# Altium schematic sheet DC-DC Converter-Test.SchDoc
size A; SheetNumber: 1; SheetTotal: 1
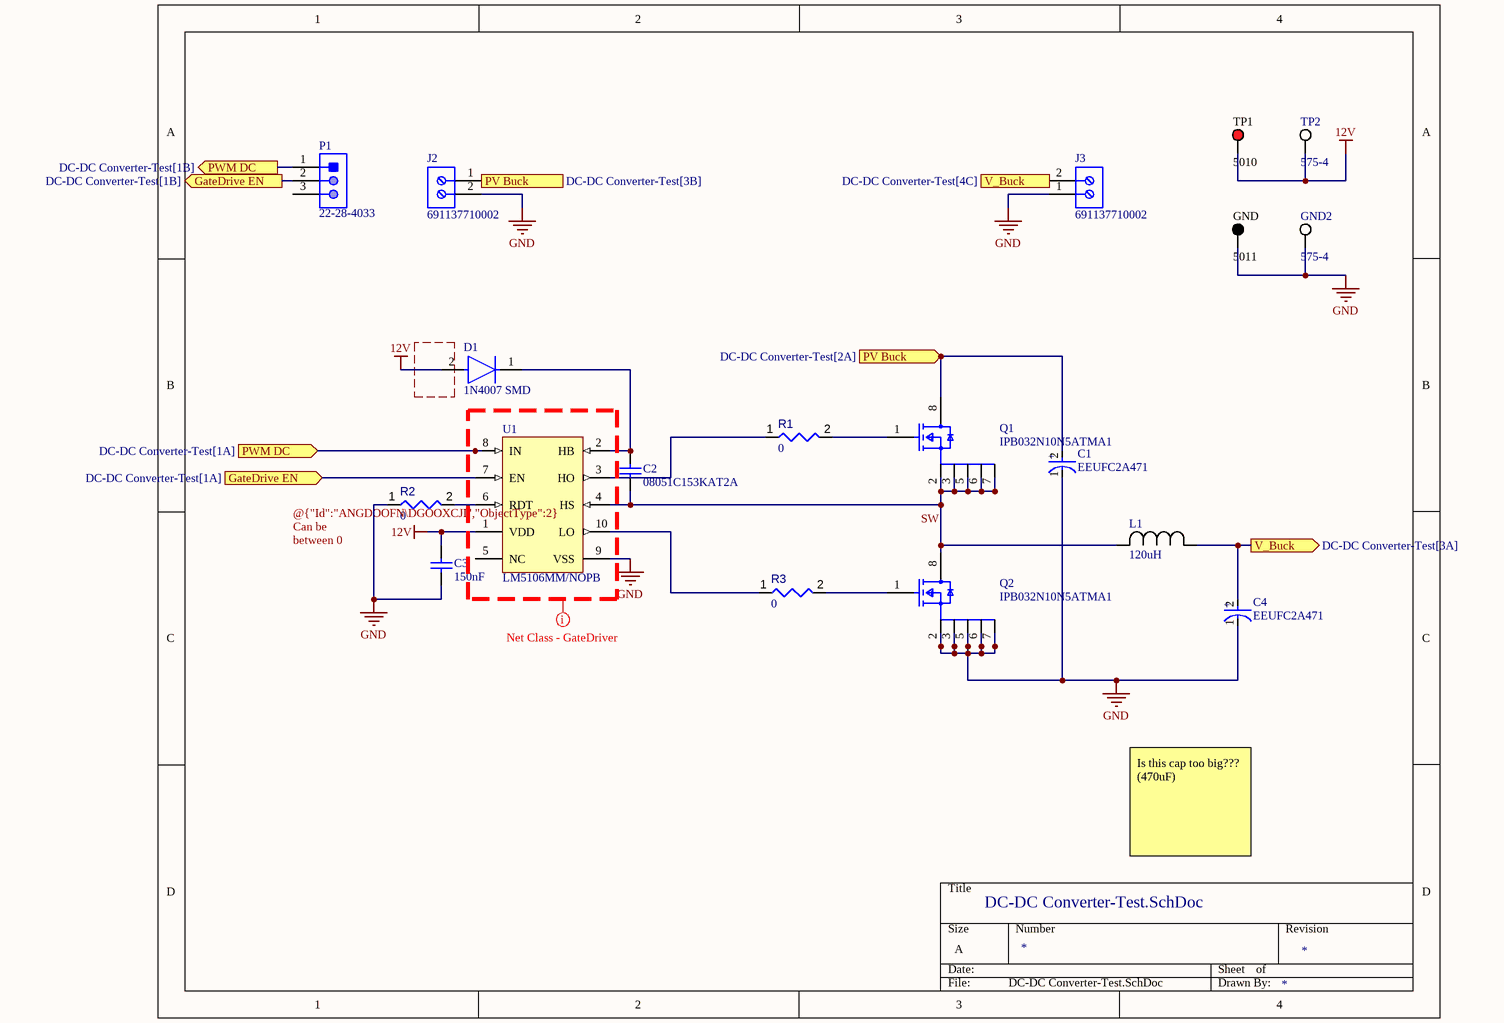
[diagram p0: DC-DC Converter-Test.SchDoc]

## Parts
C1  EEUFC2A471  [FP-RAD-TH-D_16_0_5-L_40_2-MFG]
C2  08051C153KAT2A  [CAPC2013X94X50NL20T25]
C3  150nF  [CAPC2013X140X50LL20T25]
C4  EEUFC2A471  [FP-RAD-TH-D_16_0_5-L_40_2-MFG]
D1  1N4007 SMD  [FP-1N4007_SMD-IPC_C]
GND  5011  [KSTN-5011_V]
GND2  575-4  [KSTN-575-4]
J2  691137710002  [691137710002]
J3  691137710002  [691137710002]
L1  120uH  [IND_2300HT-V_56_42]
P1  22-28-4033  [MOLX-22-28-4033_V]
Q1  IPB032N10N5ATMA1  [FP-PG-TO263-7-MFG]
Q2  IPB032N10N5ATMA1  [FP-PG-TO263-7-MFG]
R1  value 0  [RESC0603(1608)_L]  (hidden comment: 0R3J)
R2  value 0  [RESC0603(1608)_L]  (hidden comment: 0R3J)
R3  value 0  [RESC0603(1608)_L]  (hidden comment: 0R3J)
TP1  5010  [KSTN-5010_V]
TP2  575-4  [KSTN-575-4]
U1  LM5106MM/NOPB  [DGS0010A_N]

## Ports
GateDrive EN (in, see DC-DC Converter-Test[1A]), GateDrive EN (out, see DC-DC Converter-Test[1B]), PV Buck (in, see DC-DC Converter-Test[2A]), PV Buck (out, see DC-DC Converter-Test[3B]), PWM DC (in, see DC-DC Converter-Test[1A]), PWM DC (out, see DC-DC Converter-Test[1B]), V_Buck (in, see DC-DC Converter-Test[4C]), V_Buck (out, see DC-DC Converter-Test[3A])

## Nets
12V: C3.2 D1.2(A) TP1.1 TP2.1 U1.1(VDD)
GND: C1.1(C) C3.1 C4.1(C) GND.1 GND2.1 J2.2 J3.1 Q2.2(SOURCE) Q2.3(SOURCE) Q2.5(SOURCE) Q2.6(SOURCE) Q2.7(SOURCE) R2.1 U1.9(VSS)
GateDrive EN: P1.2 U1.7(EN) ; port GateDrive EN
PV Buck: C1.2(A) J2.1 Q1.8(DRAIN) ; port PV Buck
PWM DC: P1.1 U1.8(IN) ; port PWM DC
SW: C2.1 L1.2 Q1.2(SOURCE) Q1.3(SOURCE) Q1.5(SOURCE) Q1.6(SOURCE) Q1.7(SOURCE) Q2.8(DRAIN) U1.4(HS)
V_Buck: C4.2(A) J3.2 L1.1 ; port V_Buck
NetC2_2: C2.2 D1.1(C) U1.2(HB)
NetQ1_1: Q1.1(GATE) R1.2
NetQ2_1: Q2.1(GATE) R3.2
NetR1_1: R1.1 U1.3(HO)
NetR2_2: R2.2 U1.6(RDT)
NetR3_1: R3.1 U1.10(LO)

Not connected (* = marked no-connect by the designer): P1 3; U1 5(NC)

## Layout directives
net class GateDriver: (no net found under the mark)

## Notes on the sheet
- (near R2) @{"Id":"ANGDOOFN\DGOOXCJI","ObjectType":2} Can be between 0 and 150k
- Is this cap too big???
  (470uF)
- (in symbol CMP-05427-000270-1) +

## Library data of the parts
C1 C4 = CMP-05427-000270-1: Aluminum Electrolytic Capacitors (Radial Lead Type) AEC-Q200 Qualified 470uF ±20% 100V; Ripple Current: 1.92A; Impedance: 47mR; Polarity: Polar; Dielectric Material: Aluminium; Lead Diameter: 0.8mm; Life (Hours): 5000Hour; Leakage Current: 3uA; Radiation Hardening: No; REACH SVHC: No SVHC; Height: 40mm; Ratings: AEC-Q200; Max Operating Temperature: 105°C; RoHS Compliant: Yes; Construction: RADIAL; Lead Pitch: 7.5mm; Contact Plating: Tin; Voltage: 100V; Length: 40mm; Packaging: Bulk; Diameter: 16mm; Height - Seated (Max): 1.575inch; Voltage Rating (DC): 100V; Voltage Rating: 100V; ESR (Equivalent Series Resistance): 47mR; Case/Package: Radial; Lead Free: Lead Free; Tolerance: 20%; Series: FC; Capacitance: 470uF; Package Quantity: 100; Mount: Through Hole; Min Operating Temperature: -55°C; Termination: Radial
C2 = CMP-2007-04180-1: Manufacturer: AVX Interconnect / Elco; Part Number: 08051C153KAT2A
C3 = CMP-1036-04480-3: 08053C154KAT2A; Manufacturer: AVX Interconnect / Elco; Part Number: 08053C154KAT2A
D1 = CMP-12389-000001-1: Rectifier, 1Kv, 1A, Do-214Ac Rohs Compliant: Yes
GND = CMP-1672-00003-4: Test Point, Black, Through Hole, RoHS, Bulk; Manufacturer: Keystone; ComponentLink2URL: http://www.keyelco.com/product-pdf.cfm?p=1320; Colour: Black; Pins: 1; REACH SVHC: No SVHC; ComponentLink1URL: http://www.keyelco.com/; PackageReference: 5011; Contact Plating: Silver; Package Quantity: 100; Packaging: Bulk; RoHSCompliant: true; Height: 8.12 mm; PackageDescription: 1-Pin Through Hole Device, Dia 3.17 mm; Mount: Through Hole; Mounting Technology: Through Hole; DatasheetVersion: Rev. F, 12/2013; ComponentLink1Description: Manufacturer URL; Contact Material: Bronze; ComponentLink2Description: Datasheet
GND2 TP2 = CMP-2000-05649-1: Banana Jack, Non-Insulated, 1-Pin THD, RoHS, Bulk; Manufacturer: Keystone-Electronics; Package Version: Rev. B, 11/1994; Plug/Mating Plug Diameter: StandardBanana; Gender: Female; Package Reference: 575-4; Operating Temperature: -; Contact Material: Brass; Packaging: Bulk; Series: -; Category: Connectors,Interconnects; Color: -; Type: BananaJack; Contact Finish: Nickel; Features: -; Family: BananaandTipConnectors-Jacks,Plugs; Body Material: -; Manufacturer URL: http://www.keyelco.com/; Termination: Solder; Insulation: Non-Insulated; Datasheet Version: Rev. B, 11/1994; Mounting Technology: ThroughHole; Package URL: http://www.keyelco.com/product-pdf.cfm?p=2379; Mounting Type: ThroughHole; Package Description: 1-Pin Through Hole Device, Dia 7.92 mm; Datasheet URL: http://www.keyelco.com/product-pdf.cfm?p=2379; Wire Gauge: -
J2 J3 = CMP-1502-03324-2: NexarPartId: 78871135; Voltage Rating: 300V; Number of Contacts: 2; Current Rating: 16A; Lead Pitch: 5mm; Height: 11.6mm; Packaging: Box; RoHS: Non-Compliant; Contact Material: Nickel, Tin; Max Operating Temperature: 120°C; Number of Pins: 2; Min Operating Temperature: -30°C; Number of Rows: 1
L1 = 2300HT-121-V-RC: 120uH / 2300HT-121-V-RC; Mfr_Name: Bourns Electronics
P1 = CMP-1676-00001-5: Male Header, Pitch 2.54 mm, 1 x 3 Position, Height 8.38 mm, Tail Length 3.18 mm, RoHS, Bulk; Manufacturer: Molex; Rows: 1; Voltage Rating: 250 V; Current Rating: 4 A; Min Operating Temperature: 0 degC; Lead Pitch: 0.1 inch; Packaging: Bulk; Contact Finish: Gold; RoHSCompliant: true; Contact Material: Brass; PackageReference: 22-28-4033; REACH SVHC: Unknown; PackageDescription: Male Header, Pitch 2.54 mm, 1 x 3 Position, Height 8.38 mm, Tail Length 3.18 mm; ComponentLink2URL: http://www.molex.com/pdm_docs/sd/022284033_sd.pdf; Height: 8.38 mm; Mounting Technology: Through Hole; ComponentLink1Description: Manufacturer URL; Length: 7.62 mm; Mount: Through Hole; DatasheetVersion: Rev. G, 01/2012; Max Operating Temperature: 75 degC; ComponentLink2Description: Datasheet; Colour: Black; Pins: 3; Contact Plating: Gold; Package Quantity: 1; ComponentLink1URL: http://www.molex.com/
Q1 Q2 = CMP-32901-001276-1: MOSFET N-CH 100V 166A TO263-7; Input Capacitance: 6.97nF; Max Power Dissipation: 187W; Rds On Max: 3.2mR; Min Operating Temperature: -55°C; Mount: Surface Mount; RoHS Compliant: Yes; Continuous Drain Current (ID): 166A; Packaging: Tape and Reel; Case/Package: TO-263-7; Halogen Free: Halogen Free; Max Dual Supply Voltage: 100V; Lead Free: Contains Lead; Drain to Source Voltage (Vdss): 100V; Max Operating Temperature: 175°C; Series: OptiMOS™
R1-R3 = CMP-009-00063-2: Jumper 0603 (1608 Metric); Case/Package: 0603; Mounting Technology: SMT; Pins: 2
TP1 = CMP-1672-00002-4: Test Point, Red, Through Hole, RoHS, Bulk; Manufacturer: Keystone; Contact Material: Bronze; Mounting Technology: Through Hole; RoHSCompliant: true; Pins: 1; Package Quantity: 100; ComponentLink2Description: Datasheet; Height: 8.12 mm; ComponentLink1URL: http://www.keyelco.com/; DatasheetVersion: Rev. F, 12/2013; Mount: Through Hole; PackageReference: 5010; Contact Plating: Silver; Packaging: Bulk; Colour: Red; REACH SVHC: No SVHC; PackageDescription: 1-Pin Through Hole Device, Dia 3.17 mm; ComponentLink2URL: http://www.keyelco.com/product-pdf.cfm?p=1319; ComponentLink1Description: Manufacturer URL
U1 = CMP-0063-01354-3: 100V Half-Bridge Gate Driver with Programmable Dead-Time, 10-pin MSOP, Pb-Free; Manufacturer: Texas Instruments; PackageTopMarking: ZXTT*5106; PowerWise: N; CompType: MiscPower; PinCount: 10; Code_JEDEC: MO-187-BA; PackageReference: DGS0010A; PackageDescription: Mini-SO, Molded, .118 x .118 x .034in Body, 10 Lead, .0197in Pitch; ComponentLink1URL: http://www.ti.com/general/docs/lit/getliterature.tsp?genericPartNumber=LM5106&fileType=pdf; ComponentLink1Description: Datasheet URL; RoHS: Y